# EAGLE design MegaShield (EAGLE 7.6.0)
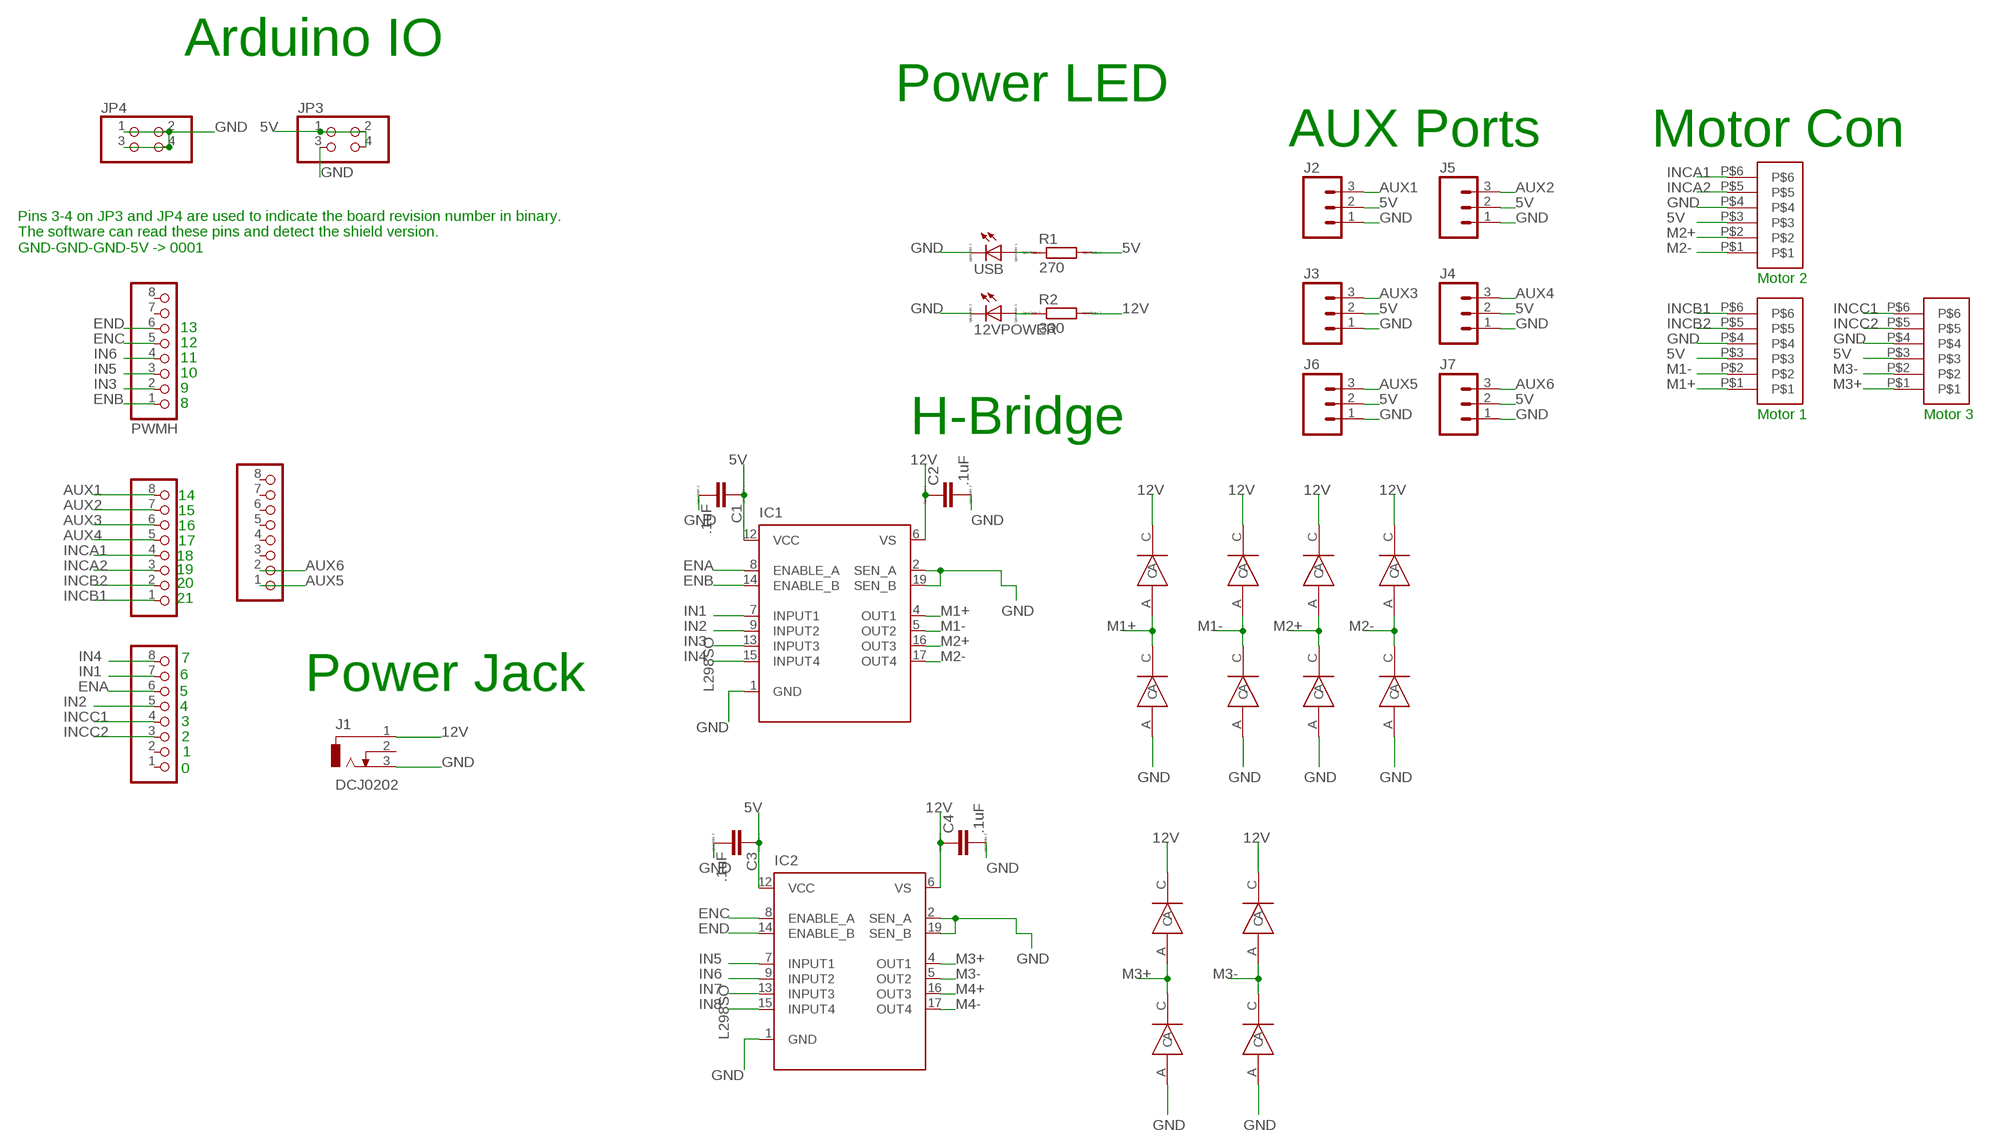
[diagram p0: schematic, sheet 1]

## Parts
12VPOWER  LED_E  [LED_1206]
C1  .1uF  C  [C0805]
C2  .1uF  C  [C0805]
C3  .1uF  C  [C0805]
C4  .1uF  C  [C0805]
COMMUNICATION  PINHD-1X8  [1X08]
COMMUNICATION1  PINHD-1X8  [1X08]
IC1  L298SO  [POWERSO-20]
IC2  L298SO  [POWERSO-20]
J1  DCJ0202  [DCJ0202]
J2  M03LOCK  [1X03_LOCK]
J3  M03LOCK  [1X03_LOCK]
J4  M03LOCK  [1X03_LOCK]
J5  M03LOCK  [1X03_LOCK]
J6  M03LOCK  [1X03_LOCK]
J7  M03LOCK  [1X03_LOCK]
JP3  PINHD-2X2  [2X02]
JP4  PINHD-2X2  [2X02]
PWMH  PINHD-1X8  [1X08]
PWML  PINHD-1X8  [1X08]
R1  270  R  [R0805]
R2  330  R  [R0805]
U$1  JST-PH-6  [JST-PHR-6-SMD]
U$2  MRA4004  [SMA]
U$3  MRA4004  [SMA]
U$4  MRA4004  [SMA]
U$5  MRA4004  [SMA]
U$6  MRA4004  [SMA]
U$7  MRA4004  [SMA]
U$8  MRA4004  [SMA]
U$9  MRA4004  [SMA]
U$10  MRA4004  [SMA]
U$11  MRA4004  [SMA]
U$12  JST-PH-6  [JST-PHR-6-SMD]
U$13  MRA4004  [SMA]
U$14  MRA4004  [SMA]
U$20  JST-PH-6  [JST-PHR-6-SMD]
USB  LED_E  [LED_1206]

## Nets
5V: C1.1 C3.1 IC1.12(VCC) IC2.12(VCC) J2.2 J3.2 J4.2 J5.2 J6.2 J7.2 JP3.1 JP3.2 JP3.4 R1.2 U$1.P$3 U$12.P$3 U$20.P$3
12V: C2.1 C4.1 IC1.6(VS) IC2.6(VS) J1.1 R2.2 U$2.C U$3.C U$5.C U$7.C U$9.C U$13.C
AUX1: COMMUNICATION.8 J2.3
AUX2: COMMUNICATION.7 J5.3
AUX3: COMMUNICATION.6 J3.3
AUX4: COMMUNICATION.5 J4.3
AUX5: COMMUNICATION1.1 J6.3
AUX6: COMMUNICATION1.2 J7.3
ENA: IC1.8(ENABLE_A) PWML.6
ENB: IC1.14(ENABLE_B) PWMH.1
ENC: IC2.8(ENABLE_A) PWMH.5
END: IC2.14(ENABLE_B) PWMH.6
GND [gnd]: 12VPOWER.C C1.2 C2.2 C3.2 C4.2 IC1.1(GND) IC1.2(SEN_A) IC1.19(SEN_B) IC2.1(GND) IC2.2(SEN_A) IC2.19(SEN_B) J1.3 J2.1 J3.1 J4.1 J5.1 J6.1 J7.1 JP3.3 JP4.1 JP4.2 JP4.3 JP4.4 U$1.P$4 U$4.A U$6.A U$8.A U$10.A U$11.A U$12.P$4 U$14.A U$20.P$4 USB.C
IN1: IC1.7(INPUT1) PWML.7
IN2: IC1.9(INPUT2) PWML.5
IN3: IC1.13(INPUT3) PWMH.2
IN4: IC1.15(INPUT4) PWML.8
IN5: IC2.7(INPUT1) PWMH.3
IN6: IC2.9(INPUT2) PWMH.4
IN7: IC2.13(INPUT3)
IN8: IC2.15(INPUT4)
INCA1: COMMUNICATION.4 U$12.P$6
INCA2: COMMUNICATION.3 U$12.P$5
INCB1: COMMUNICATION.1 U$1.P$6
INCB2: COMMUNICATION.2 U$1.P$5
INCC1: PWML.4 U$20.P$6
INCC2: PWML.3 U$20.P$5
M1+: IC1.4(OUT1) U$1.P$1 U$3.A U$4.C
M1-: IC1.5(OUT2) U$1.P$2 U$5.A U$6.C
M2+: IC1.16(OUT3) U$7.A U$8.C U$12.P$2
M2-: IC1.17(OUT4) U$9.A U$10.C U$12.P$1
M3+: IC2.4(OUT1) U$2.A U$11.C U$20.P$1
M3-: IC2.5(OUT2) U$13.A U$14.C U$20.P$2
M4+: IC2.16(OUT3)
M4-: IC2.17(OUT4)
N$2: R1.1 USB.A
N$3: 12VPOWER.A R2.1
Unconnected: COMMUNICATION1.3 COMMUNICATION1.4 COMMUNICATION1.5 COMMUNICATION1.6 COMMUNICATION1.7 COMMUNICATION1.8 J1.2 PWMH.7 PWMH.8 PWML.1 PWML.2

## Notes on the sheet
- Arduino IO
- Power LED
- AUX Ports | Motor Con
- Pins 3-4 on JP3 and JP4 are used to indicate the board revision number in binary. 
  The software can read these pins and detect the shield version.
  GND-GND-GND-5V -> 0001
- Motor 2
- 13
- 12
- 11
- 10
- 9
- 8
- Motor 1 | Motor 3
- H-Bridge
- 14
- 15
- 16
- 17
- 18
- 19
- 20
- 21
- 7
- 6
- Power Jack
- 5
- 4
- 3
- 2
- 1
- 0

## Library data of the parts
12VPOWER USB = eagle-ltspice:LED_E: LED Source: http://www.osram.convergy.de Source: www.luxeon.com Source: www.kingbright.com; SPICEMODEL: NONE; SPICEPREFIX: D; SPICETYPE: diode
C1-C4 = eagle-ltspice:C: CAPACITOR, European symbol; SPICEMODEL: NONE; SPICEPREFIX: C
COMMUNICATION COMMUNICATION1 PWMH PWML = pinhead:PINHD-1X8: PIN HEADER
IC1 IC2 = st-microelectronics:L298: DUAL FULL-BRIDGE DRIVER
J1 = con-jack:DCJ0202: DC POWER JACK Source: DCJ0202.pdf; OC_FARNELL: unknown; OC_NEWARK: unknown
J2-J7 = SparkFun-Connectors:M03: Header 3 Standard 3-pin 0.1" header. Use with straight break away headers (SKU : PRT-00116), right angle break away headers (PRT-00553), swiss pins (PRT-00743), machine pins (PRT-00117), and female headers (PRT-00115). Molex polarized connector foot print use with SKU : PRT-08232 with associated crimp pins and housings.
JP3 JP4 = pinhead:PINHD-2X2: PIN HEADER
R1 R2 = eagle-ltspice:R: RESISTOR, European symbol; SPICEMODEL: NONE; SPICEPREFIX: R
U$1 U$12 U$20 = JST-CON:JST-PH-6
U$2-U$11 U$13 U$14 = MakesmithDiode:MRA4004

## Net classes
1 power: width 0.61 mm, drill 0.711 mm, clearance 0.203 mm
2 gnd: width 0.305 mm, drill 0.711 mm, clearance 0.203 mm
3 usbvcc: width 0.508 mm, drill 0.711 mm, clearance 0.203 mm

## Board
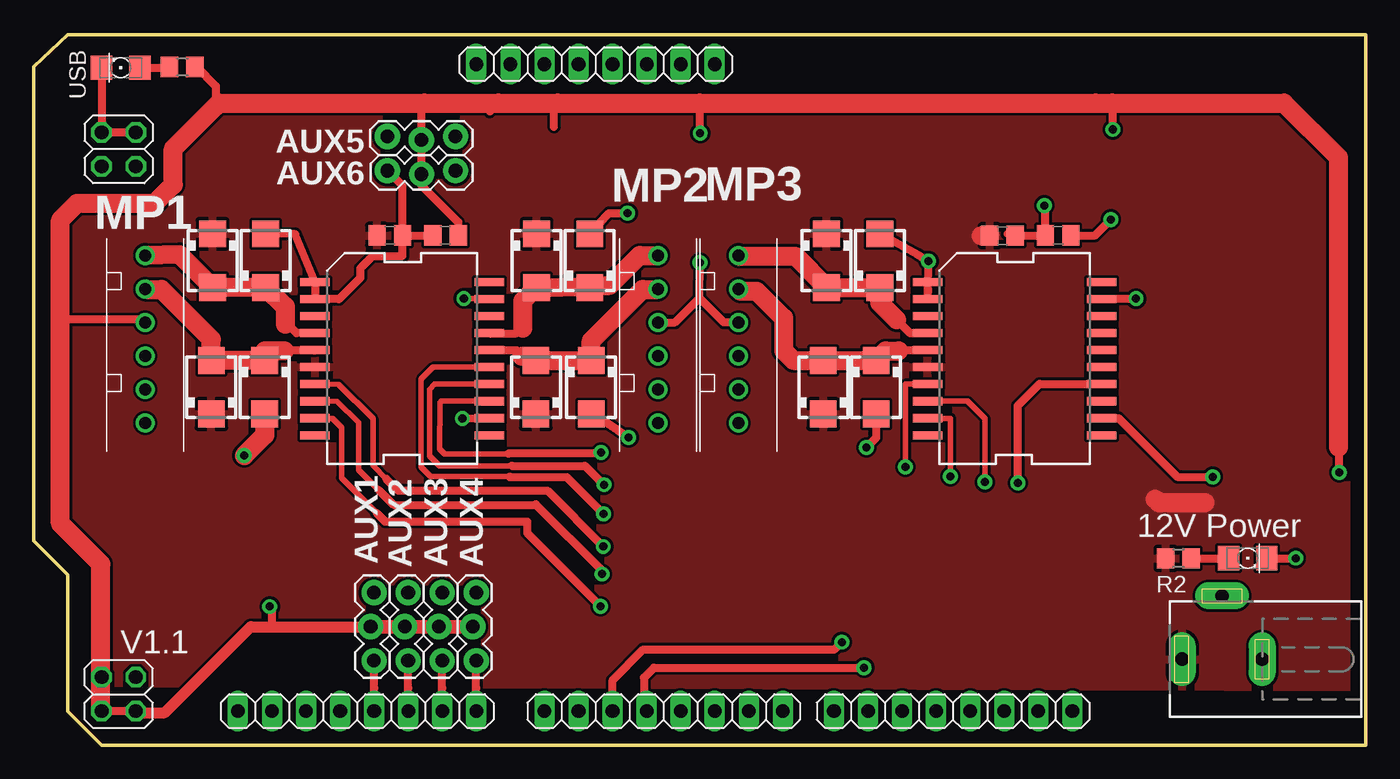
[diagram p1: board, top side]
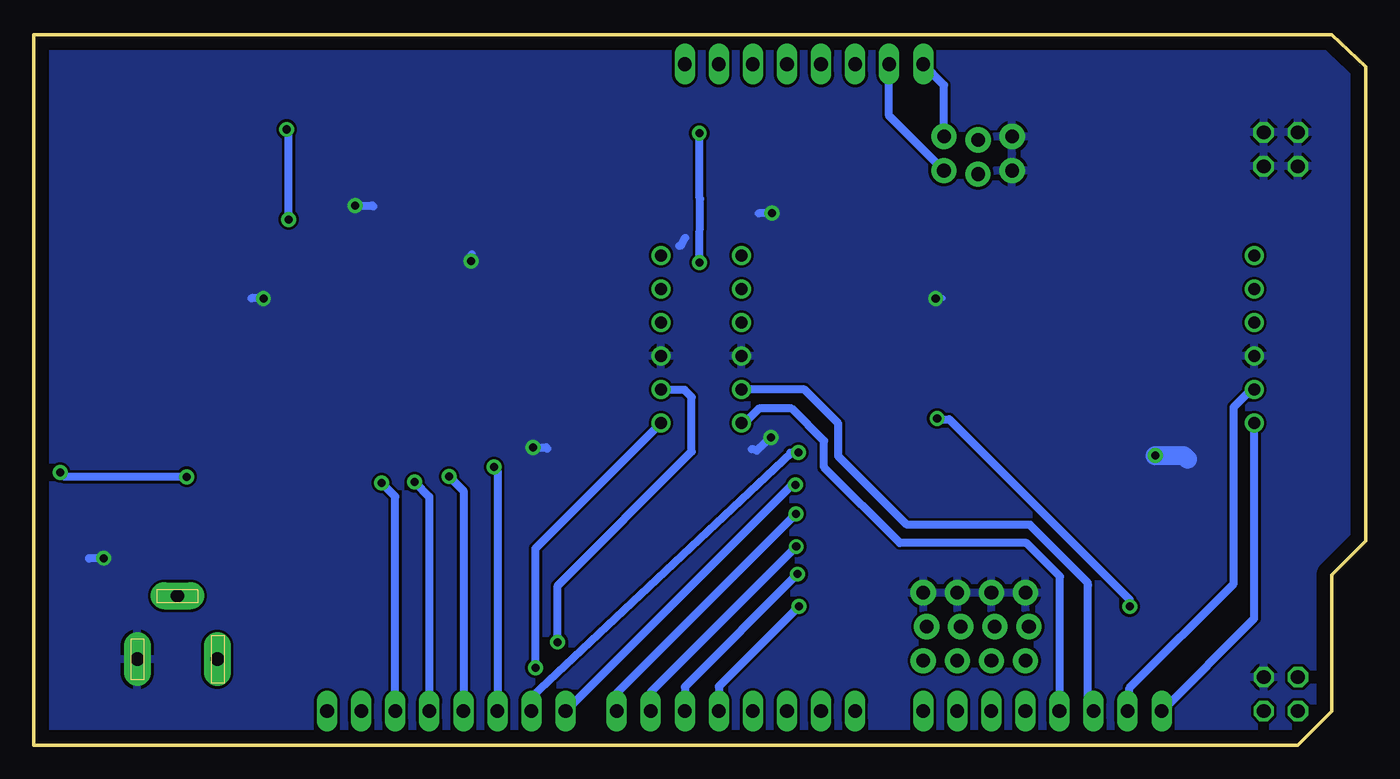
[diagram p2: board, bottom side, seen from below]

Size 99.36 x 53 mm. Coordinates in mm from the lower left corner, seen from the top.
Outline: 5.08,0 2.54,2.54 2.54,12.7 0,15.24 0,50.62 2.53,52.99 2.54,53 99.36,53 99.36,0 5.08,0
Copper layers (1*16): Top 0.035mm / dielectric 1.5mm / Bottom 0.035mm
Design rules "default *": minimum track width 8mil, minimum drill 16mil, track to track 8mil, track to pad 8mil, pad to pad 8mil, via to via 10mil, smd to smd 8mil, copper to edge 40mil, drill to drill 12mil, minimum pad ring 10mil, minimum via ring 10mil, stop-mask expansion 4mil, vias tented up to drill 0mil, thermal gap 10mil

### Footprints (pad centres in the part's own frame; a part is rotated, then mirrored left to right if it is on the bottom)
LED_1206 = smd 1.6 x 1.803: A -1.422,0; C 1.422,0
C0805 = smd 1.3 x 1.5: 1 -0.95,0; 2 0.95,0
1X08 = drill 1.016 long: 1 -8.89,0; 2 -6.35,0; 3 -3.81,0; 4 -1.27,0; 5 1.27,0; 6 3.81,0; 7 6.35,0; 8 8.89,0
POWERSO-20 = smd 0.6 x 2.2: 1 -5.715,-6.5; 2 -4.445,-6.5; 3 -3.175,-6.5; 4 -1.905,-6.5; 5 -0.635,-6.5; 6 0.635,-6.5; 7 1.905,-6.5; 8 3.175,-6.5; 9 4.445,-6.5; 10 5.715,-6.5; 11 5.715,6.5; 12 4.445,6.5; 13 3.175,6.5; 14 1.905,6.5; 15 0.635,6.5; 16 -0.635,6.5; 17 -1.905,6.5; 18 -3.175,6.5; 19 -4.445,6.5; 20 -5.715,6.5
DCJ0202 = drill 1 pad 2 long: 1 0.005,2.977; 2 4.73,-0.01; 3 0,-3
1X03_LOCK = drill 1.016 pad 1.88: 1 0,0.127; 2 2.54,-0.127; 3 5.08,0.127
2X02 = drill 1.016 octagon: 1 -1.27,-1.27; 2 -1.27,1.27; 3 1.27,-1.27; 4 1.27,1.27
R0805 = smd 1.3 x 1.5: 1 -0.95,0; 2 0.95,0
JST-PHR-6-SMD = drill 0.9: P$1 0,0; P$2 2.5,0; P$3 5,0; P$4 7.5,0; P$5 10,0; P$6 12.5,0
SMA = smd 2 x 2: A 2,0; C -2,0

### Placement (x,y rotation side)
12VPOWER  90.55,13.95 0 top
C1  30.72,38.03 180 top
C2  26.57,38.03 0 top
C3  76.41,38.03 180 top
C4  72.26,38 0 top
COMMUNICATION  24.13,2.54 0 top
COMMUNICATION1  41.91,50.8 0 top
IC1  27.49,28.83 270 top
IC2  73.17,28.83 270 top
J1  88.63,6.41 90 top
J2  32.89,11.38 270 top
J3  27.81,11.38 270 top
J4  25.27,11.38 270 top
J5  30.35,11.38 270 top
J6  26.39,45.28 0 top
J7  26.39,42.73 0 top
JP3  6.35,3.81 90 top
JP4  6.35,44.45 270 top
PWMH  68.58,2.54 0 top
PWML  46.99,2.54 0 top
R1  11.09,50.59 0 top
R2  85.38,13.93 180 top
U$1  8.33,36.53 270 top
U$2  59.13,36.15 270 top
U$3  13.35,36.15 270 top
U$4  17.3,36.15 90 top
U$5  13.26,26.7 90 top
U$6  17.25,26.7 270 top
U$7  37.46,26.7 90 top
U$8  41.59,26.7 270 top
U$9  37.52,36.15 270 top
U$10  41.48,36.15 90 top
U$11  63.11,36.15 90 top
U$12  46.57,36.53 270 top
U$13  58.89,26.7 90 top
U$14  62.83,26.7 270 top
U$20  52.57,36.53 270 top
USB  6.5,50.53 180 top

### Tracks (layer width: path | path; a pad name or v marks a point on that pad's centre or on a via)
5V  (via drill 0.6)
  Top 0.406: JP3.2 JP3.4
  Top 0.61: R1.2 12.16,50.59 13.59,49.17 13.59,47.66 | U$12.P$3 47.83,31.53 49.66,33.36 | U$20.P$3 51.48,31.53 49.66,33.36 | 49.66,33.36 v49.7,36 | JP3.1 7.44,2.54 JP3.2 | IC2.12 80.91,24.4 85.28,20.02 v87.95,20.02 | U$1.P$3 8.12,31.74 2.01,31.74 | v49.72,45.66 49.69,47.91 | 79.24,47.86 79.2,47.91 | 34.03,47.26 34.67,47.91 | 29.13,47.91 28.93,47.7 J6.2 J7.2 28.93,41.76 31.67,39.02 C1.1 | 38.8,46.13 38.8,47.6 39.11,47.91 | C3.1 79.16,38.03 v80.34,39.21 | v80.49,45.93 80.49,47.83 80.42,47.91 | v97.37,20.34 97.37,22.16 97.3,22.23 | IC1.12 33.95,24.35 v31.98,24.37 | v17.62,10.34 17.74,10.22 17.74,8.84
  Top 0.813: 7.44,2.54 7.55,2.42 9.79,2.42 16.2,8.84 17.74,8.84 J4.2
  Top 1.016: J4.2 J3.2 J5.2 J2.2
  Top 1.422: JP3.2 5.02,2.6 5.02,13.52 2.01,16.52 2.01,31.74 2.01,39.17 3.25,40.42 9.05,40.42 10.43,41.8 10.43,44.5 13.59,47.66 13.84,47.91 29.13,47.91 34.67,47.91 39.11,47.91 49.69,47.91 79.2,47.91 80.42,47.91 93.25,47.91 97.3,43.85 97.3,22.23
  Bottom 0.61: v49.7,36 49.66,40.76 49.69,40.79 v49.72,45.66 | v80.34,39.21 80.34,45.78 v80.49,45.93 | v87.95,20.02 97.05,20.02 v97.37,20.34 | v31.98,24.37 31.99,24.3 31.06,24.3 17.62,10.85 v17.62,10.34
12V
  Top 1.422: C4.1 70.67,38.01 | 83.65,18.36 83.92,18.09 87.37,18.09
  pour Top: -2.5,53.08 101.93,53.24 100.25,4.28 -2.94,4.62
AUX1
  Top 0.61: COMMUNICATION.8 33.02,4.27 J2.3
AUX2
  Top 0.61: COMMUNICATION.7 30.48,4.27 J5.3
AUX3
  Top 0.61: COMMUNICATION.6 27.94,4.27 J3.3
AUX4
  Top 0.61: COMMUNICATION.5 25.4,4.27 J4.3
AUX5
  Bottom 0.61: J6.3 31.47,49.25 COMMUNICATION1.1
AUX6
  Bottom 0.61: J7.3 35.56,46.94 COMMUNICATION1.2
ENA  (via drill 0.6)
  Top 0.406: IC1.8 22.66,25.65 24.24,24.07 24.24,20.55 25.77,19.02
  Top 0.61: 37.45,17.97 37.49,17.93 | 25.77,19.02 26.85,17.93 37.49,17.93 | 37.49,17.93 42.39,13.04 v42.39,12.76
  Bottom 0.61: v42.39,12.76 50.8,4.35 PWML.6
ENB  (via drill 0.6)
  Top 0.406: 35.66,20.84 30.27,20.84 29.54,21.57 29.54,26.55 29.92,26.93 IC1.14
  Top 0.61: 35.66,20.84 41.12,20.84 v42.54,19.43
  Bottom 0.61: v42.54,19.43 42.8,19.43 PWMH.1
ENC  (via drill 0.6)
  Top 0.406: IC2.8 69.66,25.66 70.95,24.36 v70.95,19.63
  Bottom 0.61: v70.95,19.63 69.85,18.52 PWMH.5
END  (via drill 0.6)
  Top 0.61: v73.41,19.57 73.41,25.33 75.03,26.95 79.64,26.95 IC2.14
  Bottom 0.61: PWMH.6 72.39,18.55 v73.41,19.57
GND  (via drill 0.6)
  Top 0.406: IC1.19 33.94,33.33 v32.09,33.33
  Top 0.61: U$4.A 19.53,38.11 IC1.1 IC1.2 22.79,33.27 24.39,34.87 24.39,35.58 25.29,36.49 27.52,36.49 C2.2 | IC2.2 IC2.1 66.69,33.71 v66.74,36.11 65.94,36.58 U$11.A | USB.C JP4.1 JP4.2 | U$10.A 42.9,39.69 v44.3,39.69 | U$8.A 42.73,24.07 v44.38,22.95 | 27.52,37.31 C2.2 | U$14.A 62.83,22.93 v62.12,22.21 | 72.63,38.14 C4.2 C3.2 75.46,40.18 v75.38,40.26 | 12VPOWER.C v94.13,13.95 | v94.13,13.95 | C2.2 C1.2 | C2.2 27.52,41.73 J7.1 | IC2.19 79.7,33.31 v82.22,33.31
  Top 1.422: U$6.A 17.25,23.14 v15.71,21.61
  Bottom 0.406: v32.09,33.33 32.07,33.35 31.53,33.35
  Bottom 0.61: 50.77,37.85 51.07,37.28 51.22,37.23 | v66.74,36.11 66.69,36.61 | v44.3,39.69 45.28,39.69 | v44.38,22.95 45.43,21.97 45.81,22.08 | v62.12,22.21 61.14,22.21 61.05,22.13 | v75.38,40.26 74.1,40.26 74.03,40.19 | v94.13,13.95 95.21,13.95 95.21,13.92 | v82.22,33.31 82.25,33.34 83.1,33.34
  Bottom 1.422: v15.71,21.61 13.59,21.61 13.32,21.34
  pour Bottom: -2.03,54.76 99.55,54.04 99.13,-0.41 53.78,0.1 -2.76,-2.15
IN1  (via drill 0.6)
  Top 0.406: IC1.7 22.74,26.92 25.31,24.35 25.31,20.87 26.3,19.87
  Top 0.61: 26.3,19.87 27.19,18.99 38.31,18.99 v42.49,14.81
  Bottom 0.61: v42.49,14.81 53.34,3.96 PWML.7
IN2  (via drill 0.6)
  Top 0.406: IC1.9 22.29,24.38 22.96,23.71 22.96,19.94 25.59,17.31
  Top 0.61: 25.59,17.31 26.22,16.69 36.82,16.69 36.82,15.82 v42.28,10.35
  Bottom 0.61: v42.28,10.35 48.26,4.38 PWML.5
IN3  (via drill 0.6)
  Top 0.406: 35.42,21.77 35.4,21.75 35.37,21.72 30.67,21.72 30.3,22.08 30.31,25.55 30.39,25.66 IC1.13 33.94,25.71
  Top 0.61: 35.4,21.75 42.24,21.75 v42.33,21.83
  Bottom 0.61: 42.94,21.83 42.85,21.83 | 42.85,21.83 v42.33,21.83 | PWMH.2 62.23,3.6 42.85,21.83
IN4  (via drill 0.6)
  Top 0.406: 35.51,20.02 35.44,20.09 35.41,20.05 29.63,20.05 28.92,20.76 28.92,27.3 29.81,28.2 IC1.15
  Top 0.61: 35.51,20.02 35.52,20 39.76,20 v42.51,17.26
  Bottom 0.61: v42.51,17.26 55.88,3.88 PWML.8
IN5  (via drill 0.6)
  Top 0.406: IC2.7 65.02,26.93 v65.02,20.76
  Bottom 0.61: v65.02,20.76 64.77,20.51 PWMH.3
IN6  (via drill 0.6)
  Top 0.406: IC2.9 68.38,24.39 v68.38,20.05
  Top 0.61: 67.51,24.39 IC2.9
  Bottom 0.61: v68.38,20.05 67.31,18.98 PWMH.4
INCA1
  Bottom 0.61: COMMUNICATION.4 22.82,2.58 22.82,12.59 25.31,15.08 34.76,15.08 40.42,20.73 40.42,22.71 42.82,25.11 45.27,25.11 46.35,24.03 U$12.P$6
INCA2
  Top 0.61: 46.44,26.4 U$12.P$5
  Bottom 0.61: COMMUNICATION.3 20.73,2.95 20.73,11.93 20.74,11.94 20.74,12.12 25.05,16.44 34.22,16.44 39.34,21.55 39.34,24 41.87,26.53 U$12.P$5
INCB1
  Bottom 0.61: COMMUNICATION.1 8.33,9.45 U$1.P$6
INCB2
  Bottom 0.61: COMMUNICATION.2 17.64,2.68 17.64,4.26 9.86,12.04 9.86,24.54 9.87,24.55 9.87,25.22 8.56,26.53 U$1.P$5
INCC1  (via drill 0.6)
  Top 0.61: v61.93,5.78 46.26,5.78 45.52,5.04 45.52,2.74 arc90 PWML.4
  Bottom 0.61: v61.93,5.78 61.93,14.66 U$20.P$6
INCC2  (via drill 0.6)
  Top 0.61: PWML.3 43.18,4.85 45.46,7.13 59.72,7.13 v60.27,7.69
  Bottom 0.61: v60.27,7.69 60.27,11.9 50.28,21.89 50.28,25.97 50.81,26.5 52.54,26.5 U$20.P$5
M1+
  Top 0.61: IC1.4 19.61,30.73 18.76,31.58
  Top 1.422: U$1.P$1 10.9,36.59 U$3.A 17.25,34.15 U$4.C 18.76,32.74 18.76,31.58 18.76,31.39
M1-
  Top 0.61: IC1.5 20.96,29.43 18.72,29.43
  Top 1.422: U$1.P$2 8.43,34 9.55,34 13.26,30.28 U$5.A | 18.72,29.43 17.25,29.43 U$6.C U$5.A | 13.26,28.74 U$5.A
M2+
  Top 0.61: IC1.16 36.05,29.46 36.09,29.43 36.09,29.34 36.43,29
  Top 1.422: 36.43,29 36.57,29 U$7.A U$8.C 41.59,30.16 45.43,34 46.54,34 U$12.P$2
M2-
  Top 0.61: IC1.17 arc90 34.02,30.71 36,30.71 36.39,31.09 36.47,31.09
  Top 1.422: U$12.P$1 45.19,36.53 42.96,34.3 41.51,34.3 U$10.C 41.41,34.19 U$9.A 36.47,33.15 36.47,31.09
M3+
  Top 0.61: 64.38,31.71 65.36,30.74 IC2.4
  Top 1.422: U$20.P$1 52.62,36.48 56.8,36.48 U$2.A U$11.C 63.11,32.98 64.38,31.71
M3-
  Top 0.61: 64.5,29.41 64.56,29.47 IC2.5
  Top 1.422: U$20.P$2 52.73,33.87 53.92,33.87 55.93,31.86 55.93,29.43 56.66,28.7 U$13.A U$14.C 63.54,29.41 64.5,29.41
N$2
  Top 0.61: USB.A 10.07,50.53 R1.1
N$3
  Top 0.61: R2.1 89.12,13.93 12VPOWER.A

### Text on the board
tPlace: AUX5 | AUX6 | MP2 | MP3 | MP1 | 12V Power | AUX1 | AUX2 | AUX3 | AUX4 | V1.1